# Altium schematic sheet DigitalSignalConditioning.SchDoc
size A4; CompanyName: Technische Hochschule Nürnberg Georg Simon Ohm; Organization: UltraZohm; Address1: Kesslerplatz 12; Address2: 90489 Nürnberg; Address3: GERMANY; DocumentNumber: 2; SheetNumber: 2; SheetTotal: 2; Website: www.ultrazohm.com
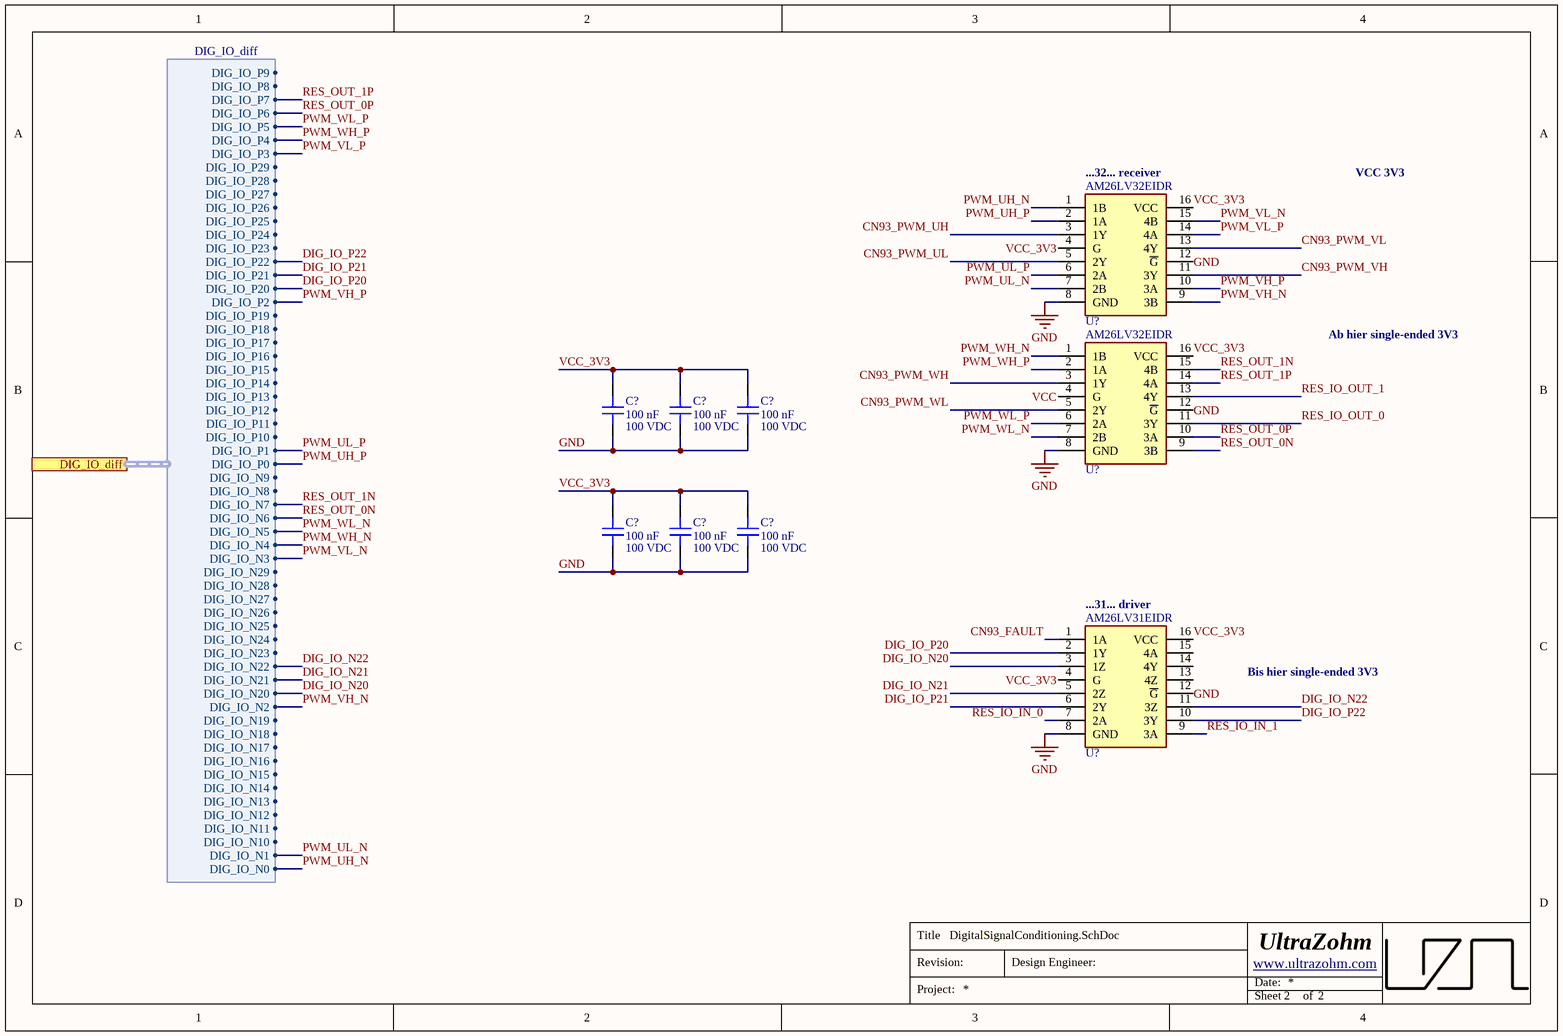
[diagram p0: DigitalSignalConditioning.SchDoc]

## Parts
(Parts that share a designator on the sheet are numbered #1, #2 ... from top to bottom, then left to right.)
C?#1  100 nF  Voltage Rating: 100 VDC  [C_0603]
C?#2  100 nF  Voltage Rating: 100 VDC  [C_0603]
C?#3  100 nF  Voltage Rating: 100 VDC  [C_0603]
C?#4  100 nF  Voltage Rating: 100 VDC  [C_0603]
C?#5  100 nF  Voltage Rating: 100 VDC  [C_0603]
C?#6  100 nF  Voltage Rating: 100 VDC  [C_0603]
U?#1  AM26LV32EIDR  [SOIC-16]
U?#2  AM26LV32EIDR  [SOIC-16]
U?#3  AM26LV31EIDR  [SOIC-16]

## Ports
DIG_IO_diff (harness DIG_IO_diff)

## Harnesses
DIG_IO_diff: DIG_IO_N0, DIG_IO_N1, DIG_IO_N10, DIG_IO_N11, DIG_IO_N12, DIG_IO_N13, DIG_IO_N14, DIG_IO_N15, DIG_IO_N16, DIG_IO_N17, DIG_IO_N18, DIG_IO_N19, DIG_IO_N2, DIG_IO_N20, DIG_IO_N21, DIG_IO_N22, DIG_IO_N23, DIG_IO_N24, DIG_IO_N25, DIG_IO_N26, DIG_IO_N27, DIG_IO_N28, DIG_IO_N29, DIG_IO_N3, DIG_IO_N4, DIG_IO_N5, DIG_IO_N6, DIG_IO_N7, DIG_IO_N9, DIG_IO_P0, DIG_IO_P1, DIG_IO_P10, DIG_IO_P11, DIG_IO_P12, DIG_IO_P13, DIG_IO_P14, DIG_IO_P15, DIG_IO_P16, DIG_IO_P17, DIG_IO_P18, DIG_IO_P19, DIG_IO_P2, DIG_IO_P20, DIG_IO_P21, DIG_IO_P22, DIG_IO_P23, DIG_IO_P24, DIG_IO_P25, DIG_IO_P26, DIG_IO_P27, DIG_IO_P28, DIG_IO_P29, DIG_IO_P3, DIG_IO_P4, DIG_IO_P5, DIG_IO_P6, DIG_IO_P7, DIG_IO_P8, DIG_IO_P9, DIG_IO_N8

## Nets
GND: C?#1.1 C?#2.1 C?#3.1 C?#4.1 C?#5.1 C?#6.1 U?#1.8(GND) U?#1.12(~{G}) U?#2.8(GND) U?#2.12(~{G}) U?#3.8(GND) U?#3.12(~{G})
CN93_FAULT: U?#3.1(1A)
CN93_PWM_UH: U?#1.3(1Y)
CN93_PWM_UL: U?#1.5(2Y)
CN93_PWM_VH: U?#1.11(3Y)
CN93_PWM_VL: U?#1.13(4Y)
CN93_PWM_WH: U?#2.3(1Y)
CN93_PWM_WL: U?#2.5(2Y)
DIG_IO_N20: U?#3.3(1Z) ; port DIG_IO_diff.DIG_IO_N20
DIG_IO_N21: U?#3.5(2Z) ; port DIG_IO_diff.DIG_IO_N21
DIG_IO_N22: U?#3.11(3Z) ; port DIG_IO_diff.DIG_IO_N22
DIG_IO_P20: U?#3.2(1Y) ; port DIG_IO_diff.DIG_IO_P20
DIG_IO_P21: U?#3.6(2Y) ; port DIG_IO_diff.DIG_IO_P21
DIG_IO_P22: U?#3.10(3Y) ; port DIG_IO_diff.DIG_IO_P22
PWM_UH_N: U?#1.1(1B) ; port DIG_IO_diff.DIG_IO_N0
PWM_UH_P: U?#1.2(1A) ; port DIG_IO_diff.DIG_IO_P0
PWM_UL_N: U?#1.7(2B) ; port DIG_IO_diff.DIG_IO_N1
PWM_UL_P: U?#1.6(2A) ; port DIG_IO_diff.DIG_IO_P1
PWM_VH_N: U?#1.9(3B) ; port DIG_IO_diff.DIG_IO_N2
PWM_VH_P: U?#1.10(3A) ; port DIG_IO_diff.DIG_IO_P2
PWM_VL_N: U?#1.15(4B) ; port DIG_IO_diff.DIG_IO_N3
PWM_VL_P: U?#1.14(4A) ; port DIG_IO_diff.DIG_IO_P3
PWM_WH_N: U?#2.1(1B) ; port DIG_IO_diff.DIG_IO_N4
PWM_WH_P: U?#2.2(1A) ; port DIG_IO_diff.DIG_IO_P4
PWM_WL_N: U?#2.7(2B) ; port DIG_IO_diff.DIG_IO_N5
PWM_WL_P: U?#2.6(2A) ; port DIG_IO_diff.DIG_IO_P5
RES_IO_IN_0: U?#3.7(2A)
RES_IO_IN_1: U?#3.9(3A)
RES_IO_OUT_0: U?#2.11(3Y)
RES_IO_OUT_1: U?#2.13(4Y)
RES_OUT_0N: U?#2.9(3B) ; port DIG_IO_diff.DIG_IO_N6
RES_OUT_0P: U?#2.10(3A) ; port DIG_IO_diff.DIG_IO_P6
RES_OUT_1N: U?#2.15(4B) ; port DIG_IO_diff.DIG_IO_N7
RES_OUT_1P: U?#2.14(4A) ; port DIG_IO_diff.DIG_IO_P7
VCC: U?#2.4(G)
VCC_3V3: C?#1.2 C?#2.2 C?#3.2 C?#4.2 C?#5.2 C?#6.2 U?#1.4(G) U?#1.16(VCC) U?#2.16(VCC) U?#3.4(G) U?#3.16(VCC)

Not connected (* = marked no-connect by the designer): U?#3 13(4Z) 14(4Y) 15(4A)

## Notes on the sheet
- (near U?#1) ...32... receiver
- VCC 3V3
- Ab hier single-ended 3V3
- (near U?#3) ...31... driver
- Bis hier single-ended 3V3
- Title
- Revision:
- Design Engineer:
- Date:
- Project:
- Sheet
- of

## Library data of the parts
C?#1-C?#6 = C1608X7S2A104KT000N: 100V 100nF X7S ±10% 0603 Multilayer Ceramic Capacitors MLCC - SMD/SMT ROHS; Manufacturer: TDK; Created from: AGeiger; Manufacturer Part Number: C1608X7S2A104KT000N; PartID: 148; Created On: 20.12.2020 13:54:13; ComponentLink1Description: Datasheet; ComponentLink1URL: https://datasheet.lcsc.com/lcsc/2304140030_TDK-C1608X7S2A104KT000N_C343025.pdf; Component Type: Capacitor 0603; Device Package: 0603; Last Updated: 14.12.2022 12:14:21; Mounting Type: SMD; Operating Temperature: -55 to 125°C; Series: X7R; Supplier 1: LCSC; Supplier Part Number 1: C343025; Type: Capacitor; Tolerance: 10 %; Value: 100 nF; Live Cycle Status: 1; LCSC Part Number: C343025; Stock number: not stored
U?#1 U?#2 = AM26LV32EIDR: Low-Voltage High-Speed Quadruple Differential Line Receiver; Manufacturer: Texas Instruments; Created from: FRosner; Manufacturer Part Number: AM26LV32EIDR; PartID: 5; Created On: 01.06.2026 09:11:13; ComponentLink1Description: Datasheet; ComponentLink1URL: https://www.ti.com/lit/ds/symlink/am26lv32e.pdf?ts=1780288728581; Component Type: RS-422-IC-Interface; Device Package: SOIC-16; Last Updated: 01.06.2026 09:11:13; Minimum Order: 1; Mounting Type: SMD; Operating Temperature: -40 - 125 °C; Series: AM26LV32E; Supplier 1: Mouser; Supplier Part Number 1: 595-AM26LV32EIDR; Supplier 2: LCSC; Supplier Part Number 2: C527448; Type: Standard; Live Cycle Status: 1; Stock number: not stored; LCSC Part Number: C527448
U?#3 = AM26LV31EIDR: Low-Voltage High-Speed Quadruple Differential Line Driver; Manufacturer: Texas Instruments; Created from: FRosner; Manufacturer Part Number: AM26LV31EIDR; PartID: 6; Created On: 01.06.2026 09:17:22; ComponentLink1Description: Datasheet; ComponentLink1URL: https://www.ti.com/lit/ds/symlink/am26lv31e.pdf?ts=1780283358979&ref_url=https%253A%252F%252Fwww.mouser.com%252F; Component Type: RS-422-IC-Interface; Device Package: SOIC-16; Last Updated: 01.06.2026 09:17:22; Minimum Order: 1; Mounting Type: SMD; Operating Temperature: -40 - 125 °C; Series: AM26LV31E; Supplier 1: Mouser; Supplier Part Number 1: 595-AM26LV31EIDR; Supplier 2: LCSC; Supplier Part Number 2: C527446; Type: Standard; Live Cycle Status: 1; Stock number: not stored; LCSC Part Number: C527446